# EAGLE schematic avocado-rev01.ODL (EAGLE 9.3.1)

## Sheet 1 of 5
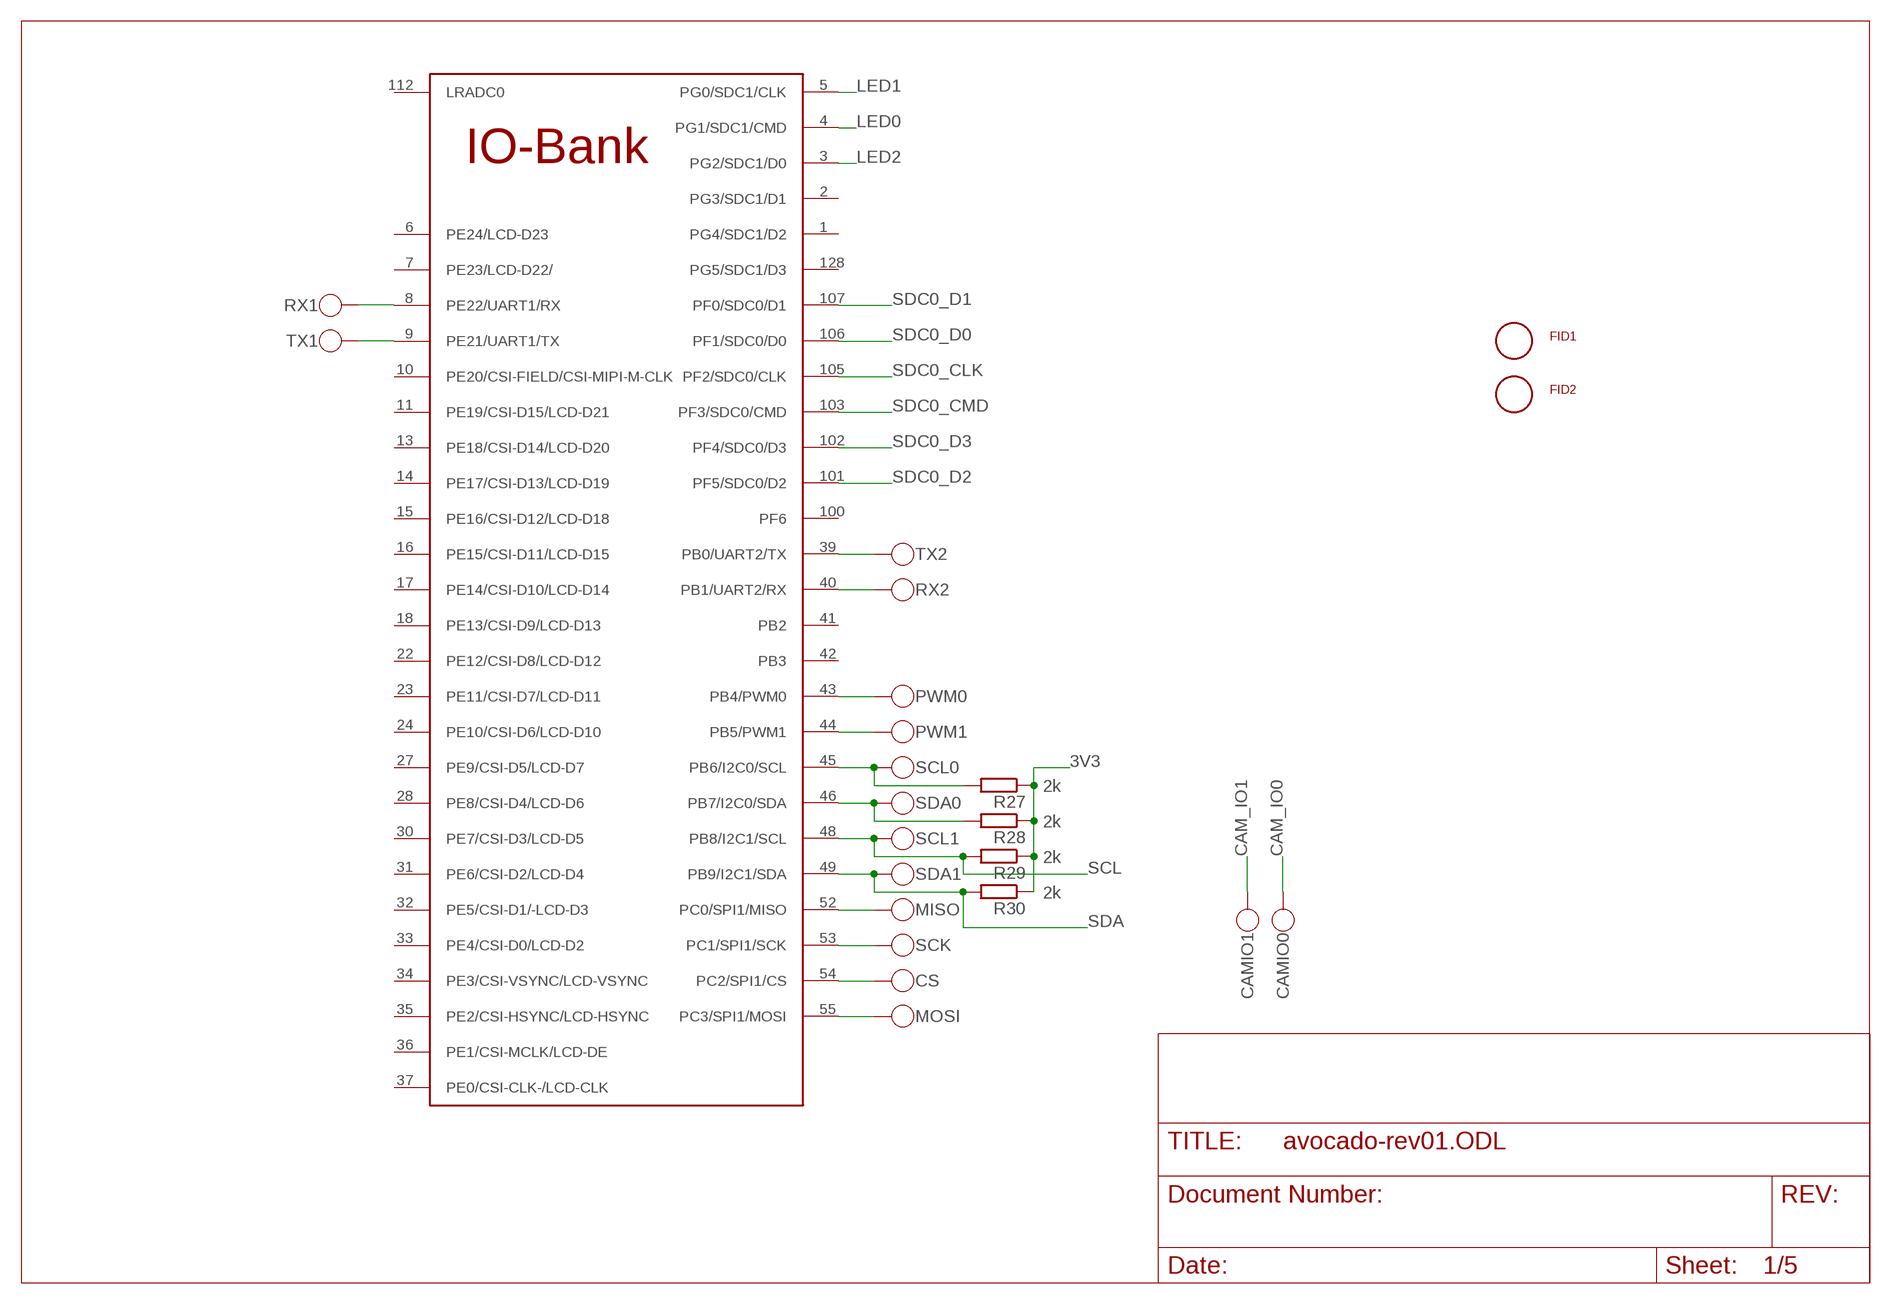
[diagram p0: schematic, sheet 1]

### Parts
CAMIO0  TEST_TESTPOINT  [TEST_TESTPOINT]
CAMIO1  TEST_TESTPOINT  [TEST_TESTPOINT]
CS  TEST_TESTPOINT  [TEST_TESTPOINT]
FID1  FIDUCIAL  [FIDUCIAL_1MM]
FID2  FIDUCIAL  [FIDUCIAL_1MM]
MISO  TEST_TESTPOINT  [TEST_TESTPOINT]
MOSI  TEST_TESTPOINT  [TEST_TESTPOINT]
PWM0  TEST_TESTPOINT  [TEST_TESTPOINT]
PWM1  TEST_TESTPOINT  [TEST_TESTPOINT]
R27  2k  R-EU_R0603  [R0603]
R28  2k  R-EU_R0603  [R0603]
R29  2k  R-EU_R0603  [R0603]
R30  2k  R-EU_R0603  [R0603]
RX1  TEST_TESTPOINT  [TEST_TESTPOINT]
RX2  TEST_TESTPOINT  [TEST_TESTPOINT]
SCK  TEST_TESTPOINT  [TEST_TESTPOINT]
SCL0  TEST_TESTPOINT  [TEST_TESTPOINT]
SCL1  TEST_TESTPOINT  [TEST_TESTPOINT]
SDA0  TEST_TESTPOINT  [TEST_TESTPOINT]
SDA1  TEST_TESTPOINT  [TEST_TESTPOINT]
TX1  TEST_TESTPOINT  [TEST_TESTPOINT]
TX2  TEST_TESTPOINT  [TEST_TESTPOINT]
U1  V3S  [QFP-128]

### Nets
3V3 [power]: R27.1 R28.1 R29.1 R30.1 ; also sheet 3,4,5
CAM_IO0: CAMIO0.1 ; also sheet 3
CAM_IO1: CAMIO1.1 ; also sheet 3
LED0: U1.4(PG1/SDC1/CMD) ; also sheet 3
LED1: U1.5(PG0/SDC1/CLK) ; also sheet 3
LED2: U1.3(PG2/SDC1/D0) ; also sheet 3
N$47: TX2.1 U1.39(PB0/UART2/TX)
N$48: RX2.1 U1.40(PB1/UART2/RX)
N$49: R27.2 SCL0.1 U1.45(PB6/I2C0/SCL)
N$50: R28.2 SDA0.1 U1.46(PB7/I2C0/SDA)
N$53: MISO.1 U1.52(PC0/SPI1/MISO)
N$54: SCK.1 U1.53(PC1/SPI1/SCK)
N$55: CS.1 U1.54(PC2/SPI1/CS)
N$56: MOSI.1 U1.55(PC3/SPI1/MOSI)
N$57: PWM0.1 U1.43(PB4/PWM0)
N$58: PWM1.1 U1.44(PB5/PWM1)
N$59: TX1.1 U1.9(PE21/UART1/TX)
N$60: RX1.1 U1.8(PE22/UART1/RX)
SCL: R29.2 SCL1.1 U1.48(PB8/I2C1/SCL) ; also sheet 2,3
SDA: R30.2 SDA1.1 U1.49(PB9/I2C1/SDA) ; also sheet 2,3
SDC0_CLK: U1.105(PF2/SDC0/CLK) ; also sheet 3
SDC0_CMD: U1.103(PF3/SDC0/CMD) ; also sheet 3
SDC0_D0: U1.106(PF1/SDC0/D0) ; also sheet 3
SDC0_D1: U1.107(PF0/SDC0/D1) ; also sheet 3
SDC0_D2: U1.101(PF5/SDC0/D2) ; also sheet 3
SDC0_D3: U1.102(PF4/SDC0/D3) ; also sheet 3
Unconnected: U1.1(PG4/SDC1/D2) U1.2(PG3/SDC1/D1) U1.6(PE24/LCD-D23) U1.7(PE23/LCD-D22/) U1.10(PE20/CSI-FIELD/CSI-MIPI-M-CLK) U1.11(PE19/CSI-D15/LCD-D21) U1.13(PE18/CSI-D14/LCD-D20) U1.14(PE17/CSI-D13/LCD-D19) U1.15(PE16/CSI-D12/LCD-D18) U1.16(PE15/CSI-D11/LCD-D15) U1.17(PE14/CSI-D10/LCD-D14) U1.18(PE13/CSI-D9/LCD-D13) U1.22(PE12/CSI-D8/LCD-D12) U1.23(PE11/CSI-D7/LCD-D11) U1.24(PE10/CSI-D6/LCD-D10) U1.27(PE9/CSI-D5/LCD-D7) U1.28(PE8/CSI-D4/LCD-D6) U1.30(PE7/CSI-D3/LCD-D5) U1.31(PE6/CSI-D2/LCD-D4) U1.32(PE5/CSI-D1/-LCD-D3) U1.33(PE4/CSI-D0/LCD-D2) U1.34(PE3/CSI-VSYNC/LCD-VSYNC) U1.35(PE2/CSI-HSYNC/LCD-HSYNC) U1.36(PE1/CSI-MCLK/LCD-DE) U1.37(PE0/CSI-CLK-/LCD-CLK) U1.41(PB2) U1.42(PB3) U1.100(PF6) U1.112(LRADC0) U1.128(PG5/SDC1/D3)

## Sheet 2 of 5
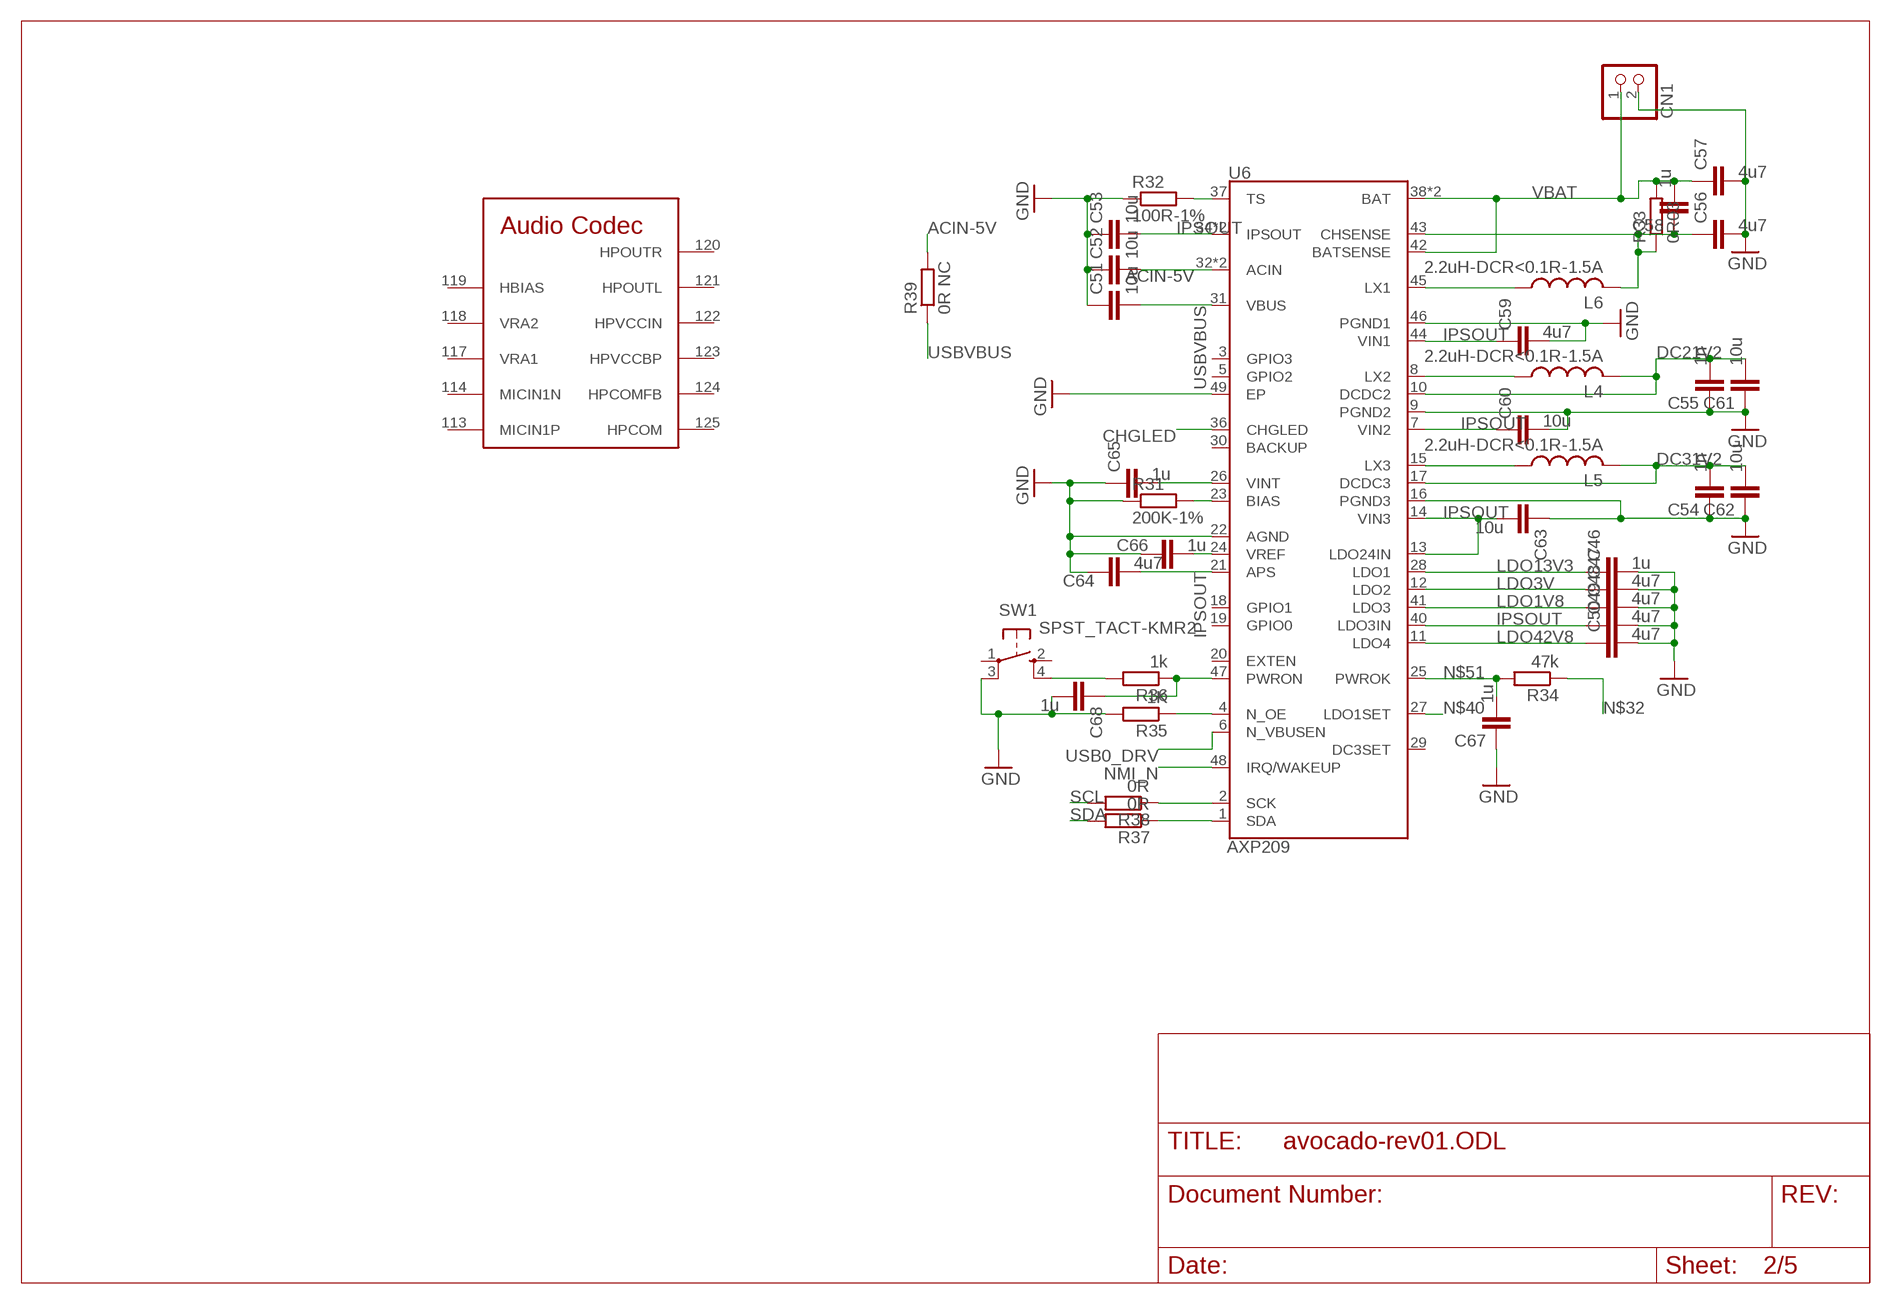
[diagram p1: schematic, sheet 2]

### Parts
C46  1u  C0603  [C0603]
C47  4u7  C0603  [C0603]
C48  4u7  C0603  [C0603]
C49  4u7  C0603  [C0603]
C50  4u7  C0603  [C0603]
C51  10u  C0603  [C0603]
C52  10u  C0603  [C0603]
C53  10u  C0603  [C0603]
C54  1n  C0603  [C0603]
C55  1n  C0603  [C0603]
C56  4u7  C0603  [C0603]
C57  4u7  C0603  [C0603]
C58  1u  C0603  [C0603]
C59  4u7  C0603  [C0603]
C60  10u  C0603  [C0603]
C61  10u  C0603  [C0603]
C62  10u  C0603  [C0603]
C63  10u  C0603  [C0603]
C64  4u7  C0603  [C0603]
C65  1u  C0603  [C0603]
C66  1u  C0603  [C0603]
C67  1u  C0603  [C0603]
C68  1u  C0603  [C0603]
CN1  JST_2PIN-SMT-RA  [JST-PH-2-SMT-RA]
L4  2.2uH-DCR<0.1R-1.5A  L6X6  [B82462A4153K]
L5  2.2uH-DCR<0.1R-1.5A  L6X6  [B82462A4153K]
L6  2.2uH-DCR<0.1R-1.5A  L6X6  [B82462A4153K]
R31  200K-1%  R-EU_R0402  [R0402]
R32  100R-1%  R-EU_R0402  [R0402]
R33  0R03  R-EU_R1206  [R1206]
R34  47k  R-EU_R0402  [R0402]
R35  1K  R-EU_R0402  [R0402]
R36  1k  R-EU_R0402  [R0402]
R37  0R  R-EU_R0402  [R0402]
R38  0R  R-EU_R0402  [R0402]
R39  0R NC  R-EU_R0402  [R0402]
SW1  SPST_TACT-KMR2  [KMR2]
U6  AXP209  [QFN40P600X600X80-49N]

### Nets
ACIN-5V: C52.2 R39.2 U6.32(ACIN) U6.33(ACIN)
CHGLED: U6.36(CHGLED)
DC21V2 [power]: C55.2 C61.2 L4.P$2 U6.10(DCDC2)
DC31V2 [power]: C54.2 C62.2 L5.P$2 U6.17(DCDC3)
GND: C46.2 C47.2 C48.2 C49.2 C50.2 C51.1 C52.1 C53.1 C54.1 C55.1 C56.2 C57.2 C59.2 C60.2 C61.1 C62.1 C63.1 C64.1 C65.1 C66.1 C67.1 C68.2 CN1.2 R31.1 R32.1 R35.2 SW1.3(P1) U6.9(PGND2) U6.16(PGND3) U6.22(AGND) U6.46(PGND1) U6.49(EP) ; also sheet 3,4,5
IPSOUT: C49.1 C53.2 C59.1 C60.1 C63.2 C64.2 U6.7(VIN2) U6.13(LDO24IN) U6.14(VIN3) U6.21(APS) U6.34(IPSOUT) U6.35(IPSOUT) U6.40(LDO3IN) U6.44(VIN1)
LDO1V8: C48.1 U6.41(LDO3)
LDO3V: C47.1 U6.12(LDO2)
LDO13V3: C46.1 U6.28(LDO1)
LDO42V8: C50.1 U6.11(LDO4)
N$7: L4.P$1 U6.8(LX2)
N$8: L6.P$1 U6.45(LX1)
N$26: L5.P$1 U6.15(LX3)
N$32: R34.1
N$40: U6.27(LDO1SET)
N$51: C67.2 R34.2 U6.25(PWROK)
N$52: R37.1 U6.1(SDA)
N$62: C56.1 C58.1 L6.P$2 R33.1 U6.43(CHSENSE)
N$64: R38.1 U6.2(SCK)
N$67: R32.2 U6.37(TS)
N$73: R31.2 U6.23(BIAS)
N$75: C68.1 R36.1 U6.47(PWRON)
N$76: R35.1 U6.4(N_OE)
N$78: C66.2 U6.24(VREF)
N$79: C65.2 U6.26(VINT)
N$81: R36.2 SW1.4(S1)
NMI_N: U6.48(IRQ/WAKEUP)
SCL: R38.2 ; also sheet 1,3
SDA: R37.2 ; also sheet 1,3
USB0_DRV: U6.6(N_VBUSEN)
USBVBUS: C51.2 R39.1 U6.31(VBUS)
VBAT: C57.1 C58.2 CN1.1 R33.2 U6.38(BAT) U6.39(BAT) U6.42(BATSENSE)
Unconnected: SW1.1(P) SW1.2(S) U1.113(MICIN1P) U1.114(MICIN1N) U1.117(VRA1) U1.118(VRA2) U1.119(HBIAS) U1.120(HPOUTR) U1.121(HPOUTL) U1.122(HPVCCIN) U1.123(HPVCCBP) U1.124(HPCOMFB) U1.125(HPCOM) U6.3(GPIO3) U6.5(GPIO2) U6.18(GPIO1) U6.19(GPIO0) U6.20(EXTEN) U6.29(DC3SET) U6.30(BACKUP)

## Sheet 3 of 5
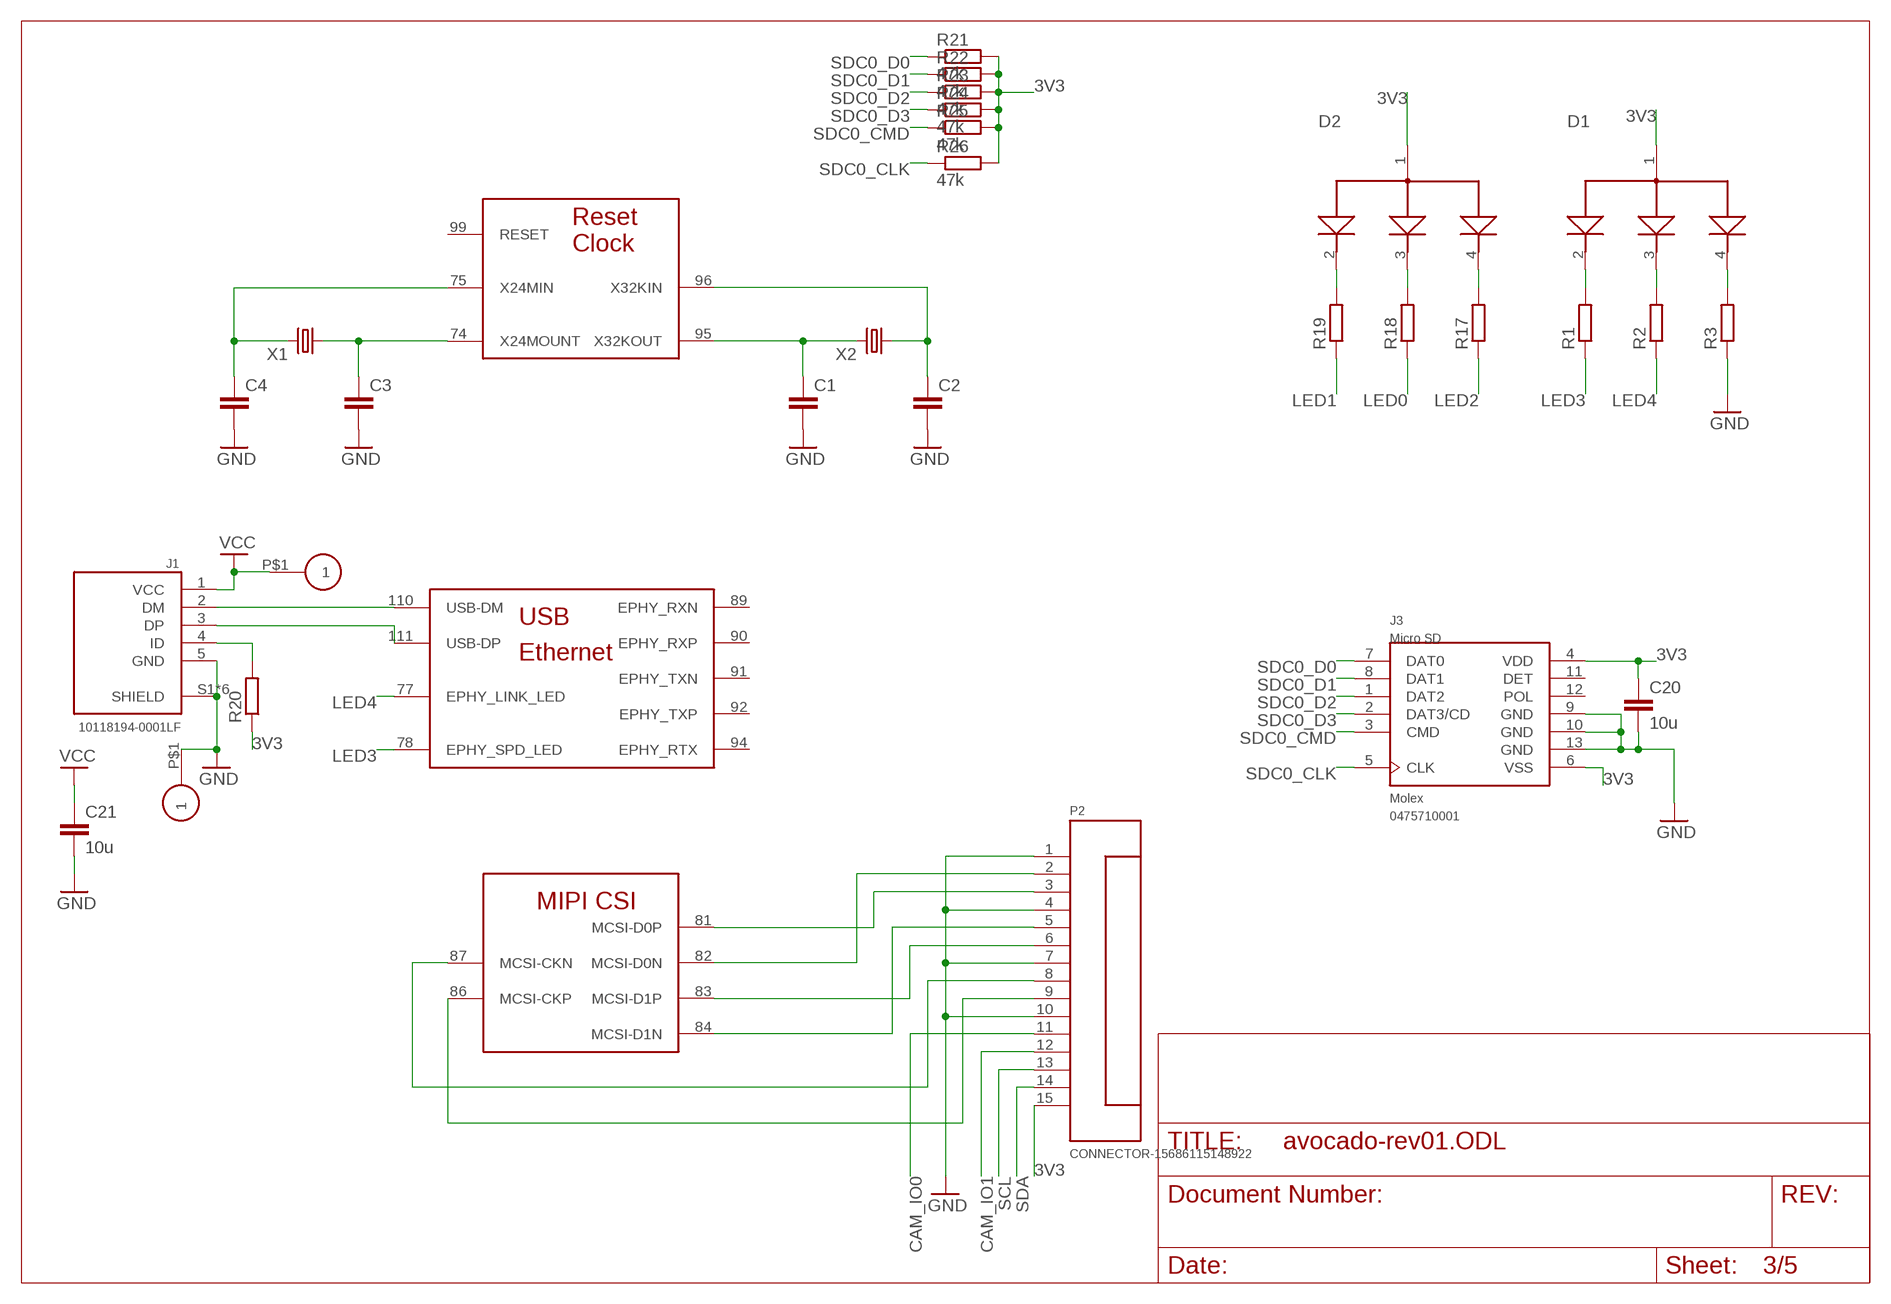
[diagram p2: schematic, sheet 3]

### Parts
5V  PADTH  [PAD]
C1  C0603  [C0603]
C2  C0603  [C0603]
C3  C0603  [C0603]
C4  C0603  [C0603]
C20  10u  C0603  [C0603]
C21  10u  C0603  [C0603]
D1  LL-R3528RGBC-008-B  [LED_LL-R3528RGBC-008-B]
D2  LL-R3528RGBC-008-B  [LED_LL-R3528RGBC-008-B]
GND  PADTH  [PAD]
J1  10118194-0001LF  [AMPHENOL_10118194-0001LF]
J3  0475710001  [MOLEX_0475710001]
P2  CONNECTOR-15686115148922  [686115148922]
R1  R-EU_R0603  [R0603]
R2  R-EU_R0603  [R0603]
R3  R-EU_R0603  [R0603]
R17  R-EU_R0603  [R0603]
R18  R-EU_R0603  [R0603]
R19  R-EU_R0603  [R0603]
R20  R-EU_R0603  [R0603]
R21  47k  R-EU_R0603  [R0603]
R22  47k  R-EU_R0603  [R0603]
R23  47k  R-EU_R0603  [R0603]
R24  47k  R-EU_R0603  [R0603]
R25  47k  R-EU_R0603  [R0603]
R26  47k  R-EU_R0603  [R0603]
X1  XTAL3.2X2  [3.2X2-4]
X2  XTAL5X1.9  [XTAL-5X1.9]

### Nets
3V3 [power]: C20.1 D1.1(COMM_ANODE) D2.1(COMM_ANODE) J3.4(VDD) J3.6(VSS) P2.15 R20.1 R21.2 R22.2 R23.2 R24.2 R25.2 R26.2 ; also sheet 1,4,5
CAM_IO0: P2.11 ; also sheet 1
CAM_IO1: P2.12 ; also sheet 1
GND: C1.2 C2.2 C3.2 C4.2 C20.2 C21.2 GND.P$1 J1.5(GND) J1.S1(SHIELD) J1.S2(SHIELD) J1.S3(SHIELD) J1.S4(SHIELD) J1.S5(SHIELD) J1.S6(SHIELD) J3.9(GND) J3.10(GND) J3.13(GND) P2.1 P2.4 P2.7 P2.10 R3.1 ; also sheet 2,4,5
LED0: R18.1 ; also sheet 1
LED1: R19.1 ; also sheet 1
LED2: R17.1 ; also sheet 1
LED3: R1.1 U1.78(EPHY_SPD_LED)
LED4: R2.1 U1.77(EPHY_LINK_LED)
N$1: C4.1 U1.75(X24MIN) X1.P$3
N$2: C3.1 U1.74(X24MOUNT) X1.P$1
N$3: C1.1 U1.95(X32KOUT) X2.P$2
N$4: C2.1 U1.96(X32KIN) X2.P$1
N$5: J1.2(DM) U1.110(USB-DM)
N$6: J1.3(DP) U1.111(USB-DP)
N$9: D2.2(CATHODE_RED) R19.2
N$10: D2.3(CATHODE_GREEN) R18.2
N$11: D2.4(CATHODE_BLUE) R17.2
N$12: D1.2(CATHODE_RED) R1.2
N$14: D1.3(CATHODE_GREEN) R2.2
N$24: D1.4(CATHODE_BLUE) R3.2
N$65: P2.2 U1.82(MCSI-D0N)
N$66: P2.3 U1.81(MCSI-D0P)
N$68: P2.5 U1.84(MCSI-D1N)
N$69: P2.6 U1.83(MCSI-D1P)
N$70: P2.8 U1.87(MCSI-CKN)
N$72: P2.9 U1.86(MCSI-CKP)
SCL: P2.13 ; also sheet 1,2
SDA: P2.14 ; also sheet 1,2
SDC0_CLK: J3.5(CLK) R26.1 ; also sheet 1
SDC0_CMD: J3.3(CMD) R25.1 ; also sheet 1
SDC0_D0: J3.7(DAT0) R21.1 ; also sheet 1
SDC0_D1: J3.8(DAT1) R22.1 ; also sheet 1
SDC0_D2: J3.1(DAT2) R23.1 ; also sheet 1
SDC0_D3: J3.2(DAT3/CD) R24.1 ; also sheet 1
USB-ID: J1.4(ID) R20.2
VCC: 5V.P$1 C21.1 J1.1(VCC) ; also sheet 5
Unconnected: J3.11(DET) J3.12(POL) U1.89(EPHY_RXN) U1.90(EPHY_RXP) U1.91(EPHY_TXN) U1.92(EPHY_TXP) U1.94(EPHY_RTX) U1.99(RESET)

## Sheet 4 of 5
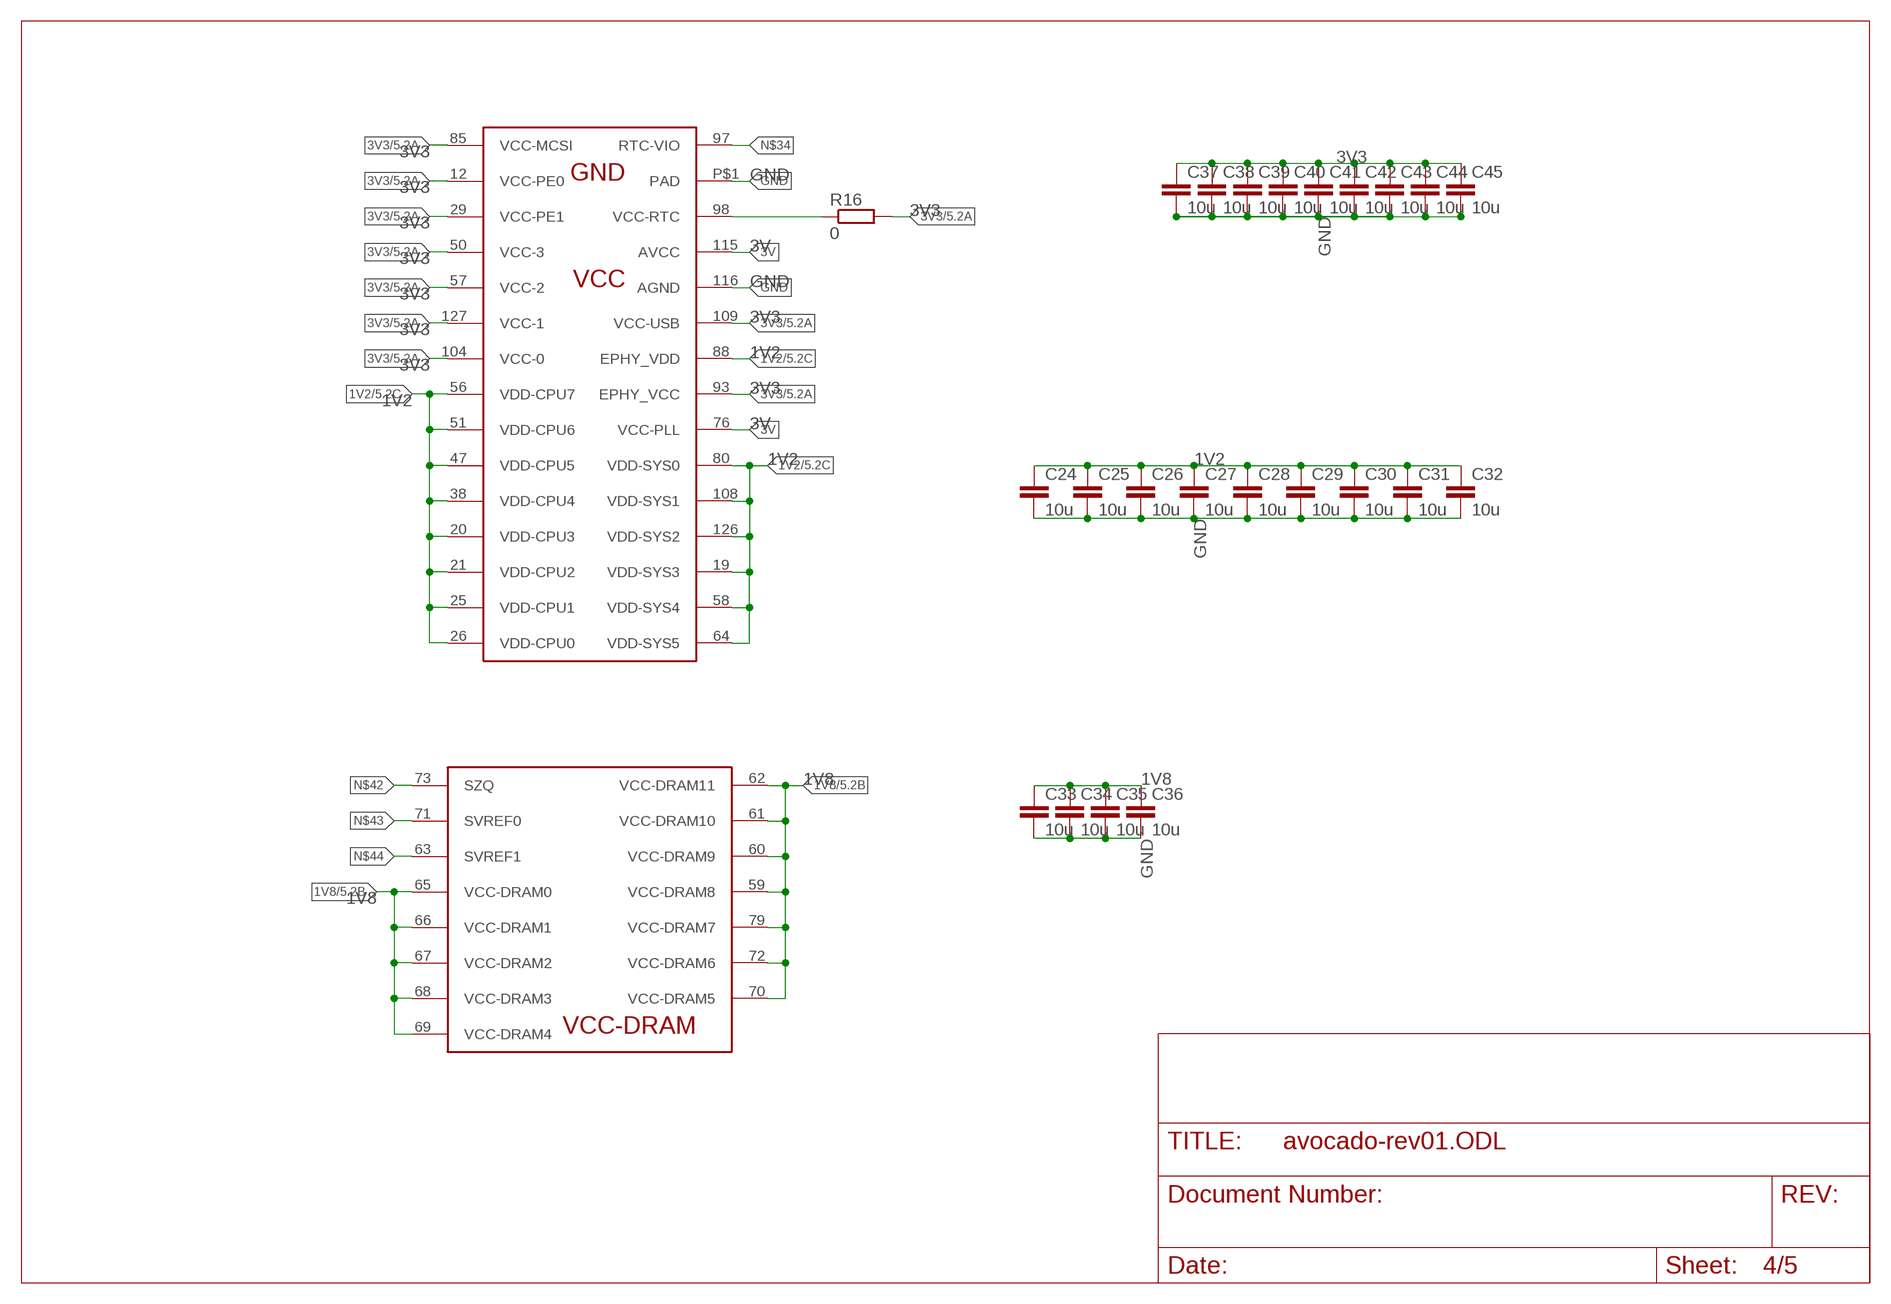
[diagram p3: schematic, sheet 4]

### Parts
C24  10u  C0603  [C0603]
C25  10u  C0603  [C0603]
C26  10u  C0603  [C0603]
C27  10u  C0603  [C0603]
C28  10u  C0603  [C0603]
C29  10u  C0603  [C0603]
C30  10u  C0603  [C0603]
C31  10u  C0603  [C0603]
C32  10u  C0603  [C0603]
C33  10u  C0603  [C0603]
C34  10u  C0603  [C0603]
C35  10u  C0603  [C0603]
C36  10u  C0603  [C0603]
C37  10u  C0603  [C0603]
C38  10u  C0603  [C0603]
C39  10u  C0603  [C0603]
C40  10u  C0603  [C0603]
C41  10u  C0603  [C0603]
C42  10u  C0603  [C0603]
C43  10u  C0603  [C0603]
C44  10u  C0603  [C0603]
C45  10u  C0603  [C0603]
R16  0  R0603  [R0603]

### Nets
1V2 [power]: C24.1 C25.1 C26.1 C27.1 C28.1 C29.1 C30.1 C31.1 C32.1 U1.19(VDD-SYS3) U1.20(VDD-CPU3) U1.21(VDD-CPU2) U1.25(VDD-CPU1) U1.26(VDD-CPU0) U1.38(VDD-CPU4) U1.47(VDD-CPU5) U1.51(VDD-CPU6) U1.56(VDD-CPU7) U1.58(VDD-SYS4) U1.64(VDD-SYS5) U1.80(VDD-SYS0) U1.88(EPHY_VDD) U1.108(VDD-SYS1) U1.126(VDD-SYS2) ; also sheet 5
1V8 [power]: C33.1 C34.1 C35.1 C36.1 U1.59(VCC-DRAM8) U1.60(VCC-DRAM9) U1.61(VCC-DRAM10) U1.62(VCC-DRAM11) U1.65(VCC-DRAM0) U1.66(VCC-DRAM1) U1.67(VCC-DRAM2) U1.68(VCC-DRAM3) U1.69(VCC-DRAM4) U1.70(VCC-DRAM5) U1.72(VCC-DRAM6) U1.79(VCC-DRAM7) ; also sheet 5
3V: U1.76(VCC-PLL) U1.115(AVCC) ; also sheet 5
3V3 [power]: C37.1 C38.1 C39.1 C40.1 C41.1 C42.1 C43.1 C44.1 C45.1 R16.2 U1.12(VCC-PE0) U1.29(VCC-PE1) U1.50(VCC-3) U1.57(VCC-2) U1.85(VCC-MCSI) U1.93(EPHY_VCC) U1.104(VCC-0) U1.109(VCC-USB) U1.127(VCC-1) ; also sheet 1,3,5
GND: C24.2 C25.2 C26.2 C27.2 C28.2 C29.2 C30.2 C31.2 C32.2 C33.2 C34.2 C35.2 C36.2 C37.2 C38.2 C39.2 C40.2 C41.2 C42.2 C43.2 C44.2 C45.2 U1.116(AGND) U1.P$1(PAD) ; also sheet 2,3,5
N$13 [power]: R16.1 U1.98(VCC-RTC)
N$34: U1.97(RTC-VIO)
N$42: U1.73(SZQ)
N$43: U1.71(SVREF0)
N$44: U1.63(SVREF1)

## Sheet 5 of 5
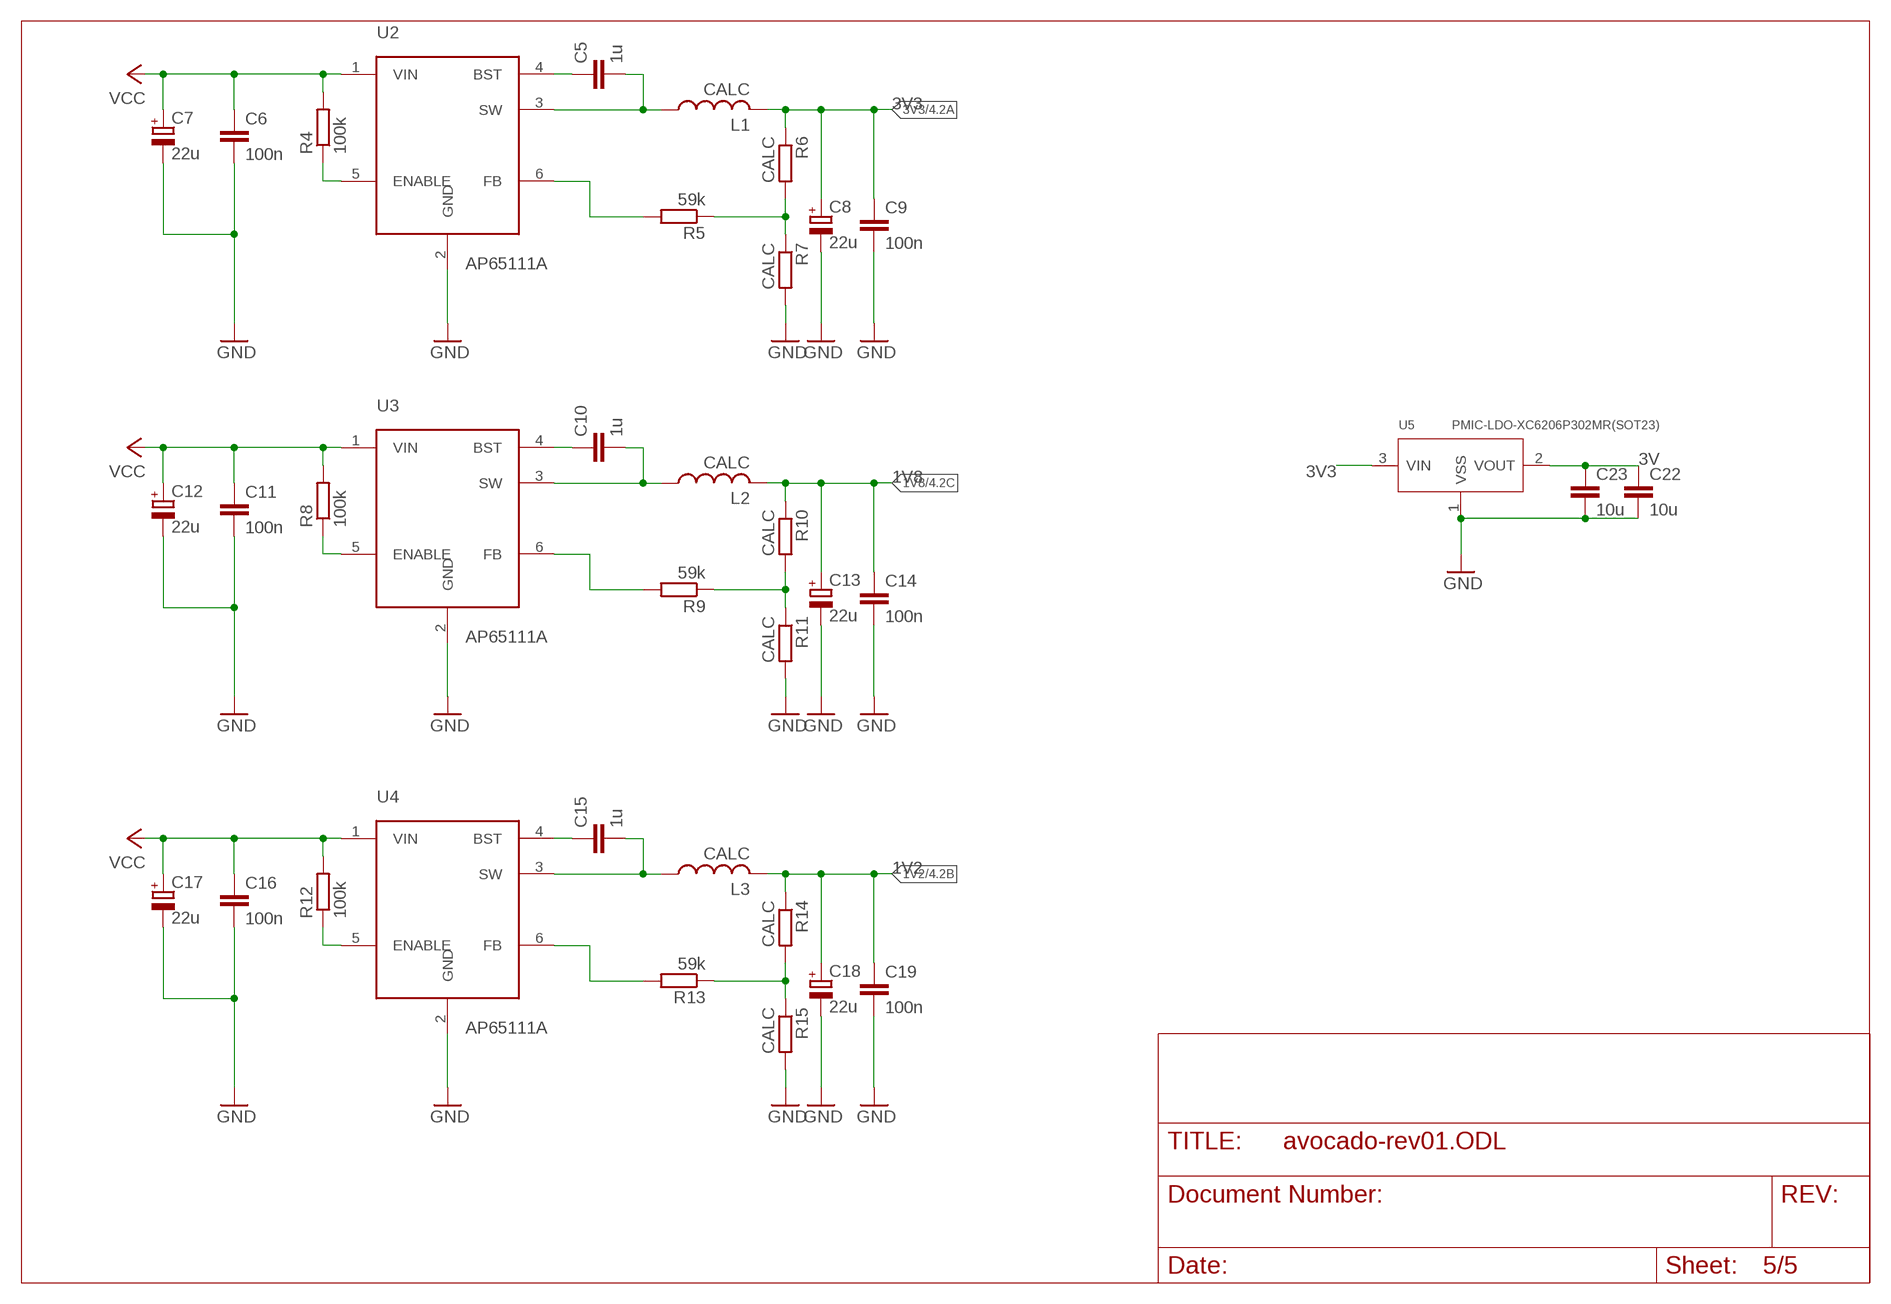
[diagram p4: schematic, sheet 5]

### Parts
C5  1u  C0603  [C0603]
C6  100n  C0603  [C0603]
C7  22u  C_POL4.3  [CAP4.3X6.1]
C8  22u  C_POL4.3  [CAP4.3X6.1]
C9  100n  C0603  [C0603]
C10  1u  C0603  [C0603]
C11  100n  C0603  [C0603]
C12  22u  C_POL4.3  [CAP4.3X6.1]
C13  22u  C_POL4.3  [CAP4.3X6.1]
C14  100n  C0603  [C0603]
C15  1u  C0603  [C0603]
C16  100n  C0603  [C0603]
C17  22u  C_POL4.3  [CAP4.3X6.1]
C18  22u  C_POL4.3  [CAP4.3X6.1]
C19  100n  C0603  [C0603]
C22  10u  C0603  [C0603]
C23  10u  C0603  [C0603]
L1  CALC  L6X6  [B82462A4153K]
L2  CALC  L6X6  [B82462A4153K]
L3  CALC  L6X6  [B82462A4153K]
R4  100k  R0603  [R0603]
R5  59k  R0603  [R0603]
R6  CALC  R0603  [R0603]
R7  CALC  R0603  [R0603]
R8  100k  R0603  [R0603]
R9  59k  R0603  [R0603]
R10  CALC  R0603  [R0603]
R11  CALC  R0603  [R0603]
R12  100k  R0603  [R0603]
R13  59k  R0603  [R0603]
R14  CALC  R0603  [R0603]
R15  CALC  R0603  [R0603]
U2  AP65111A  [TSOT26]
U3  AP65111A  [TSOT26]
U4  AP65111A  [TSOT26]
U5  PMIC-LDO-XC6206P302MR(SOT23)  [SOT-23]

### Nets
1V2 [power]: C18.1(+) C19.1 L3.P$2 R14.1 ; also sheet 4
1V8 [power]: C13.1(+) C14.1 L2.P$2 R10.1 ; also sheet 4
3V: C22.1 C23.1 U5.2(VOUT) ; also sheet 4
3V3 [power]: C8.1(+) C9.1 L1.P$2 R6.1 U5.3(VIN) ; also sheet 1,3,4
GND: C6.2 C7.2(-) C8.2(-) C9.2 C11.2 C12.2(-) C13.2(-) C14.2 C16.2 C17.2(-) C18.2(-) C19.2 C22.2 C23.2 R7.2 R11.2 R15.2 U2.2(GND) U3.2(GND) U4.2(GND) U5.1(VSS) ; also sheet 2,3,4
N$15: R5.2 U2.6(FB)
N$16: C5.2 L1.P$1 U2.3(SW)
N$17: R5.1 R6.2 R7.1
N$18: C5.1 U2.4(BST)
N$19: R4.1 U2.5(ENABLE)
N$20: R9.2 U3.6(FB)
N$21: C10.2 L2.P$1 U3.3(SW)
N$22: R9.1 R10.2 R11.1
N$23: C10.1 U3.4(BST)
N$25: R8.1 U3.5(ENABLE)
N$27: R13.2 U4.6(FB)
N$28: C15.2 L3.P$1 U4.3(SW)
N$29: R13.1 R14.2 R15.1
N$30: C15.1 U4.4(BST)
N$31: R12.1 U4.5(ENABLE)
VCC: C6.1 C7.1(+) C11.1 C12.1(+) C16.1 C17.1(+) R4.2 R8.2 R12.2 U2.1(VIN) U3.1(VIN) U4.1(VIN) ; also sheet 3

## Library data of the parts
5V GND = marius:PAD; X: X
C1-C6 C9-C11 C14-C16 C19-C68 = marius:C: Capacitor SMD
C7 C8 C12 C13 C17 C18 = marius:C_POL: Cap polarized SMD
CAMIO0 CAMIO1 CS MISO MOSI PWM0 PWM1 RX1 RX2 SCK SCL0 SCL1 SDA0 SDA1 TX1 TX2 = marius:TEST_TESTPOINT; X: X
CN1 = adafruit:JST_2PIN: JST 2-Pin Connectors of various flavors SMT-RA (S2B-PH-SM4) 4UConnector #17311 SMT (B2B-PH-SM4) THM-RA (S2B-PH) THM (B2B-PH)
D1 D2 = LL-R3528RGBC-008-B:LL-R3528RGBC-008-B: LED; SMD; 3528, PLCC2; RGB; 3.5x2.8mm; 120°; Red lumin: 1; AVAILABILITY: Unavailable; DESCRIPTION: LED; SMD; 3528, PLCC2; RGB; 3.5x2.8mm; 120°; Red lumin: 1; MF: Lucky Light; MP: LL-R3528RGBC-008-B; PACKAGE: PLCC-2 Lucky Light; PRICE: None
FID1 FID2 = marius:FIDUCIAL: For use by pick and place machines to calibrate the vision/machine, 1mm By microbuilder.eu; X: X
J1 = 10118194-0001LF:10118194-0001LF: Micro Usb, 2.0 Type b, Rcpt, Smt; AVAILABILITY: Unavailable; DESCRIPTION: Micro Usb, 2.0 Type b, Rcpt, Smt; MF: Amphenol ICC; MP: 10118194-0001LF; PACKAGE: None; PRICE: None
J3 = 0475710001:0475710001: Conn Micro SD Card HDR 8 POS 1.1mm Solder RA SMD Embossed T/R 0.5A/Contact; AVAILABILITY: Unavailable; DESCRIPTION: Conn Micro SD Card HDR 8 POS 1.1mm Solder RA SMD Embossed T/R 0.5A/Contact; MF: Molex; MP: 0475710001; PACKAGE: None; PRICE: None
L1-L6 = marius:L; MOUSER: 871-B82462A4153K; MPN: B82462A4153K
P2 = marius:CONNECTOR-15: 15-pin connectors; FARNEL: 2470725; MPN: 686115148922
R1-R3 R17-R39 = resistor:R-EU_: RESISTOR, European symbol
R4-R16 = marius:R: Resistor SMD
SW1 = adafruit:SPST_TACT: SMT 6mm switch, EVQQ2 series http://www.ladyada.net/library/eagle
U1 = marius:V3S; MPN: V3s
U2-U4 = marius:AP65111A; MPN: AP65111AWU-7
U5 = PMIC-LDO-XC6206P302MR_SOT23_:PMIC-LDO-XC6206P302MR(SOT23): 310030009; AVAILABILITY: N/A; DESCRIPTION: N/A; MF: Torex; MP: XC6206P302MR; PACKAGE: SOT-23-3 Torex; PRICE: None
U6 = AXP209:AXP209: Enhanced single Cell Li-Battery and Power System Management IC; AVAILABILITY: Unavailable; DESCRIPTION: IC; MF: X-Powers Limited; MP: AXP209; PACKAGE: Package Analog Devices; PRICE: None
X1 X2 = marius:XTAL

## Net classes
0 default: width 0.25 mm, drill 0.35 mm, clearance 0.15 mm
3 power: width 0.35 mm, drill 0.35 mm, clearance 0.15 mm